# Altium project Nixie_Driver.PrjPcb
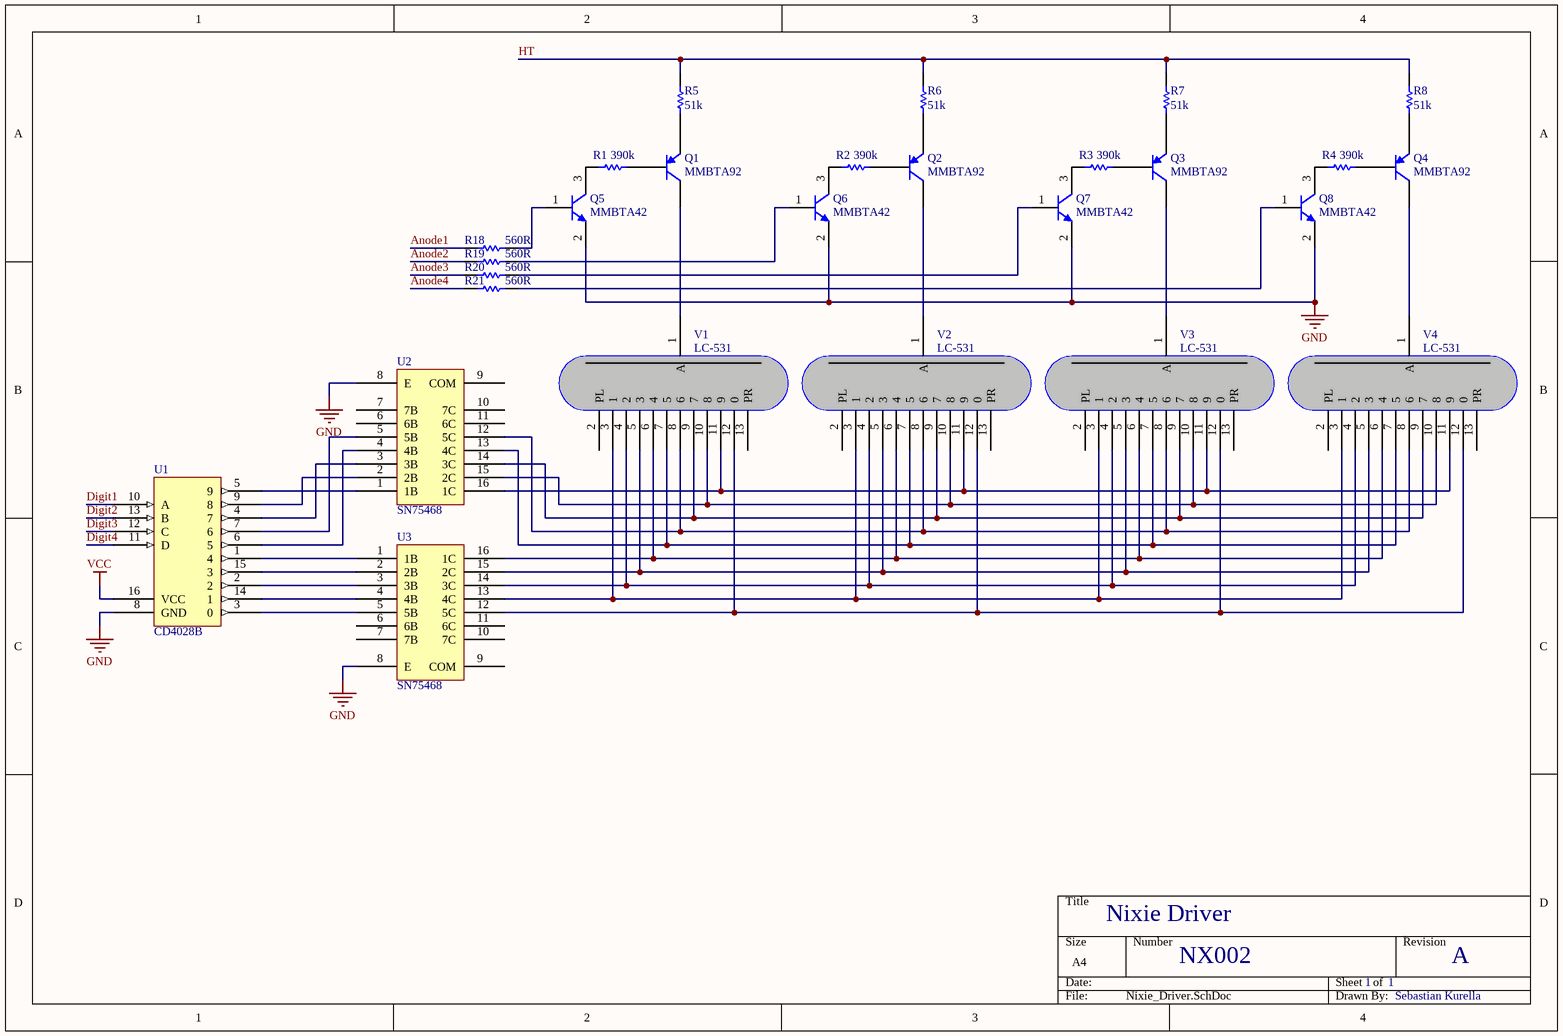
[diagram p0: Nixie_Driver.SchDoc]
3 sheets, 84 parts. Net scope: global (net labels, ports and power ports of the same name join across sheets).
Board file: Nixie_Driver.PcbDoc
Sheets:
  Nixie_Driver.SchDoc
  Nixie_Embedded_Controller.SchDoc
  Nixie_Embedded_Supply.SchDoc

## Sheet Nixie_Driver.SchDoc
size A4

### Parts
Q1  MMBTA92  [INF-SOT23_M]
Q2  MMBTA92  [INF-SOT23_M]
Q3  MMBTA92  [INF-SOT23_M]
Q4  MMBTA92  [INF-SOT23_M]
Q5  MMBTA42  [ONSC-SOT-23-3-318-08_V]
Q6  MMBTA42  [ONSC-SOT-23-3-318-08_V]
Q7  MMBTA42  [ONSC-SOT-23-3-318-08_V]
Q8  MMBTA42  [ONSC-SOT-23-3-318-08_V]
R1  value 390k  [RESC0805(2012)_M]  (hidden comment: 390K 5% 0805(2012))
R2  value 390k  [RESC0805(2012)_M]  (hidden comment: 390K 5% 0805(2012))
R3  value 390k  [RESC0805(2012)_M]  (hidden comment: 390K 5% 0805(2012))
R4  value 390k  [RESC0805(2012)_M]  (hidden comment: 390K 5% 0805(2012))
R5  value 51k  [RESC0805(2012)_M]  (hidden comment: 51K 5% 0805(2012))
R6  value 51k  [RESC0805(2012)_M]  (hidden comment: 51K 5% 0805(2012))
R7  value 51k  [RESC0805(2012)_M]  (hidden comment: 51K 5% 0805(2012))
R8  value 51k  [RESC0805(2012)_M]  (hidden comment: 51K 5% 0805(2012))
R18  560R  [RESC0805(2012)_M]
R19  560R  [RESC0805(2012)_M]
R20  560R  [RESC0805(2012)_M]
R21  560R  [RESC0805(2012)_M]
U1  CD4028B  [CD4028B]
U2  SN75468  [SN7546x]
U3  SN75468  [SN7546x]
V1  LC-531  [LC-531]
V2  LC-531  [LC-531]
V3  LC-531  [LC-531]
V4  LC-531  [LC-531]

### Nets
GND: Q5.2(E) Q6.2(E) Q7.2(E) Q8.2(E) U1.8(GND) U2.8(E) U3.8(E)
VCC: U1.16(VCC)
Anode1: R18.1
Anode2: R19.1
Anode3: R20.1
Anode4: R21.1
Digit1: U1.10(A)
Digit2: U1.13(B)
Digit3: U1.12(C)
Digit4: U1.11(D)
HT: R5.2 R6.2 R7.2 R8.2
NetQ1_1: Q1.1(B) R1.2
NetQ1_2: Q1.2(E) R5.1
NetQ1_3: Q1.3(C) V1.1(A)
NetQ2_1: Q2.1(B) R2.2
NetQ2_2: Q2.2(E) R6.1
NetQ2_3: Q2.3(C) V2.1(A)
NetQ3_1: Q3.1(B) R3.2
NetQ3_2: Q3.2(E) R7.1
NetQ3_3: Q3.3(C) V3.1(A)
NetQ4_1: Q4.1(B) R4.2
NetQ4_2: Q4.2(E) R8.1
NetQ4_3: Q4.3(C) V4.1(A)
NetQ5_1: Q5.1(B) R18.2
NetQ5_3: Q5.3(C) R1.1
NetQ6_1: Q6.1(B) R19.2
NetQ6_3: Q6.3(C) R2.1
NetQ7_1: Q7.1(B) R20.2
NetQ7_3: Q7.3(C) R3.1
NetQ8_1: Q8.1(B) R21.2
NetQ8_3: Q8.3(C) R4.1
NetU1_1: U1.1(4) U3.1(1B)
NetU1_2: U1.2 U3.3(3B)
NetU1_3: U1.3(0) U3.5(5B)
NetU1_4: U1.4(7) U2.3(3B)
NetU1_5: U1.5(9) U2.1(1B)
NetU1_6: U1.6(5) U2.4(4B)
NetU1_7: U1.7(6) U2.5(5B)
NetU1_9: U1.9(8) U2.2(2B)
NetU1_14: U1.14(1) U3.4(4B)
NetU1_15: U1.15(3) U3.2(2B)
NetU2_12: U2.12(5C) V1.8(6) V2.8(6) V3.8(6) V4.8(6)
NetU2_13: U2.13(4C) V1.7(5) V2.7(5) V3.7(5) V4.7(5)
NetU2_14: U2.14(3C) V1.9(7) V2.9(7) V3.9(7) V4.9(7)
NetU2_15: U2.15(2C) V1.10(8) V2.10(8) V3.10(8) V4.10(8)
NetU2_16: U2.16(1C) V1.11(9) V2.11(9) V3.11(9) V4.11(9)
NetU3_12: U3.12(5C) V1.12(0) V2.12(0) V3.12(0) V4.12(0)
NetU3_13: U3.13(4C) V1.3(1) V2.3(1) V3.3(1) V4.3(1)
NetU3_14: U3.14(3C) V1.4(2) V2.4(2) V3.4(2) V4.4(2)
NetU3_15: U3.15(2C) V1.5(3) V2.5(3) V3.5(3) V4.5(3)
NetU3_16: U3.16(1C) V1.6(4) V2.6(4) V3.6(4) V4.6(4)

Not connected (* = marked no-connect by the designer): U2 6(6B) 7(7B) 9(COM) 10(7C) 11(6C); U3 6(6B) 7(7B) 9(COM) 10(7C) 11(6C); V1 2(PL) 13(PR); V2 2(PL) 13(PR); V3 2(PL) 13(PR); V4 2(PL) 13(PR)

### Notes on the sheet
- Nixie Driver
- NX002
- 1
- A
- Sebastian Kurella

### Library data of the parts
Q1-Q4 = CMP-1197-00010-1: PNP Silicon High-Voltage Transistor, 300 V VCEO, 500 mA IC, SOT23, Reel, Green; Manufacturer: Infineon; hFE (min): 40; ICBO (max): 100 nA; Green: TRUE; VCE (max): 10 V; fT (typ): 50 MHz; IC (max): 500 mA; VEBO (max): 5 V; VCEO (max): 300 V; IC: 30 mA; ComponentLink3Description: Package Specification; ComponentLink2URL: http://www.infineon.com/dgdl/smbta92-mmbta92.pdf?folderId=db3a30431441fb5d011449af3ad90232&fileId=db3a30431441fb5d011449c5cd03023b; PartNumber: MMBTA92; ComponentLink1Description: Manufacturer URL; PackageReference: SOT23; Packing: Reel; ComponentLink3URL: http://www.infineon.com/dgdl/SOT23-Package_Overview.pdf?folderId=db3a30431936bc4b0119532290053c66&fileId=db3a30431936bc4b0119533468123c85; PackageVersion: Apr-08; PackageDescription: 3-Pin Small Outline Transistor Package, 1.3 x 2.9 mm Body, 0.95 mm Pitch; ComponentLink1URL: http://www.infineon.com/; Polarity: PNP; VCE: 10 V; Mounting Technology: Surface Mount; ComponentLink2Description: Datasheet; VCBO (max): 300 V
Q5-Q8 = CMP-1048-00662-1: High Voltage Transistor, NPN Silicon, 3-Pin SOT-23, Pb-Free, Tape and Reel; Manufacturer: On Semiconductor; fT Min (MHz): 50; IC Continuous (A): 0.5; ComponentLink1URL: http://www.onsemi.com/; ComponentLink3URL: http://www.onsemi.cn/pub_link/Collateral/318-08.PDF; RoHS: TRUE; ComponentLink2Description: Datasheet; PartNumber: MMBTA42; Polarity: NPN; DatasheetVersion: Rev. 12; PackageReference: SOT-23-3-318-08; PackageDescription: 3-Pin Small Outline Transistor, Body 2.92 x 1.3 mm, Pitch 0.95 mm; ComponentLink3Description: Package Specification; ComponentLink1Description: Manufacturer URL; Packing: Tape and Reel; PackageVersion: Rev. AP, 11/2009; Mounting Technology: Surface Mount; ComponentLink2URL: http://www.onsemi.cn/pub_link/Collateral/MMBTA42LT1-D.PDF
R1-R4 = CMP-1013-00136-1: 390K 0.125W 5% 0805 (2012 Metric)  SMD; Case-EIA: 0805; Case-Metric: 2012; Tolerance: 5 %; Power: 0.125 W; Technology: SMT
R5-R8 = CMP-1013-00115-1: 51K 0.125W 5% 0805 (2012 Metric)  SMD; Case-Metric: 2012; Case-EIA: 0805; Technology: SMT; Power: 0.125 W; Tolerance: 5 %
R18-R21 = CMP-1013-00068-1: 560R 0.125W 5% 0805 (2012 Metric)  SMD; Case-Metric: 2012; Value: 560.00 Ohm; Case-EIA: 0805; Power: 0.125 W; Technology: SMT; Tolerance: 5 %
U1 = CD4028B: BCD-to-decimal driver
U2 U3 = SN7546x: Darlington Transistor Array
V1-V4 = LC531: Nixie tube

## Sheet Nixie_Embedded_Controller.SchDoc
size A4
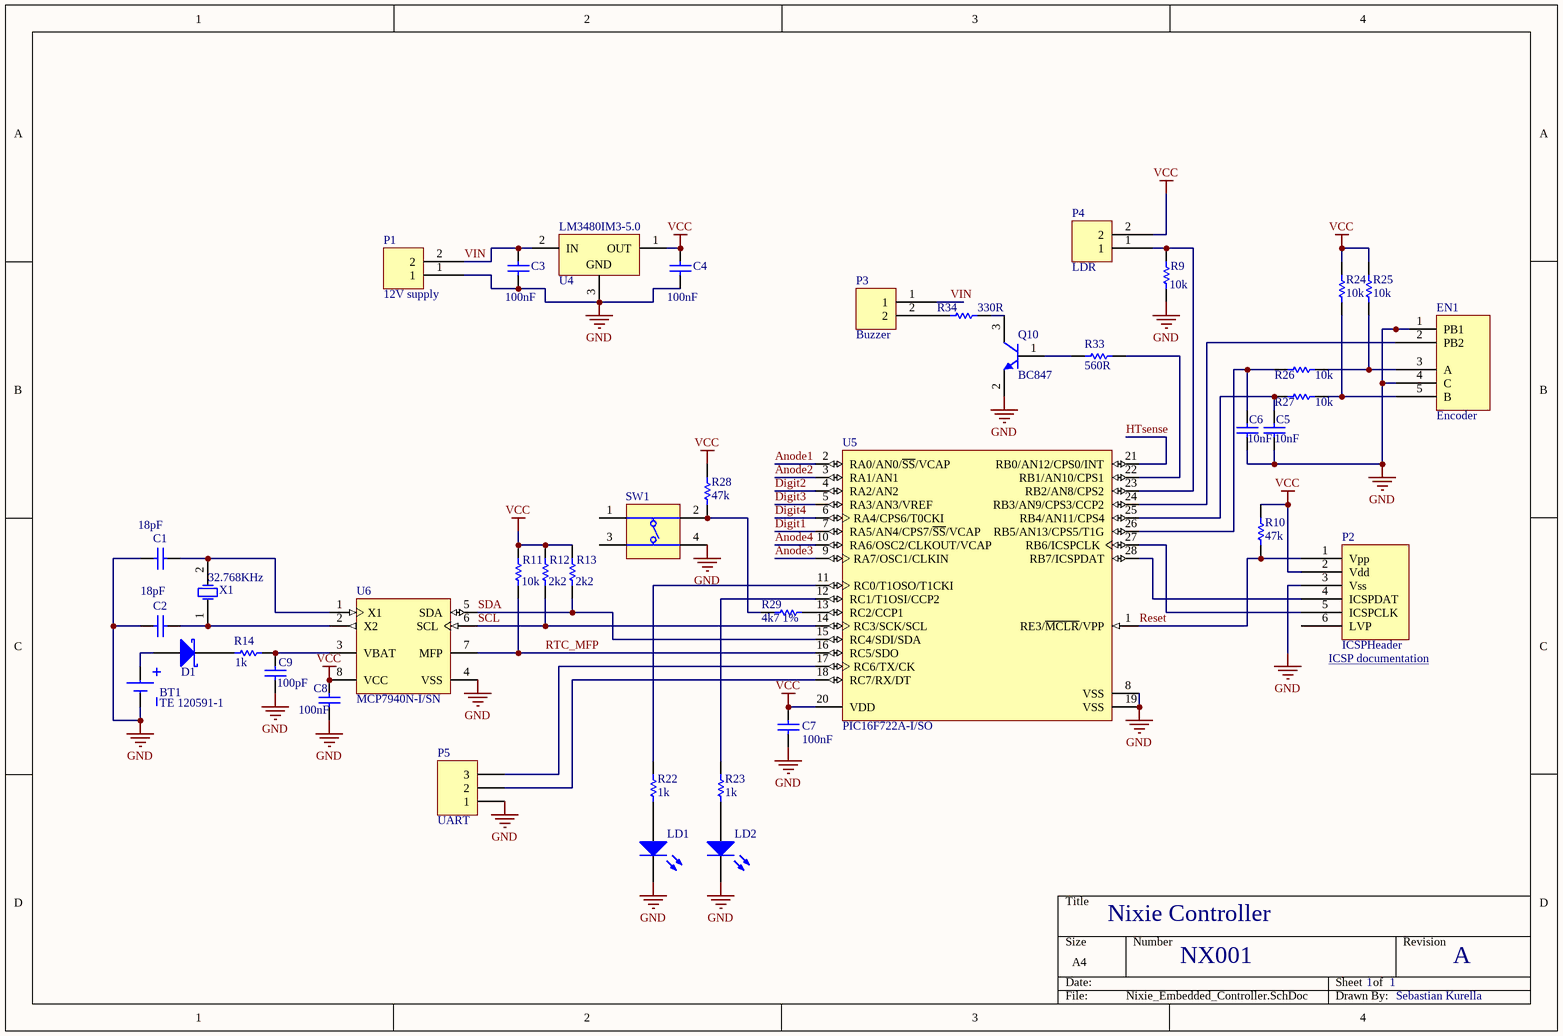
[diagram p1: Nixie_Embedded_Controller.SchDoc]

### Parts
BT1  TE 120591-1  [TE-120591-1]
C1  value 18pF  [CAPC0805(2012)100_M]  (hidden comment: CAP 18pF 16V 0805(2012))
C2  value 18pF  [CAPC0805(2012)100_M]  (hidden comment: CAP 18pF 16V 0805(2012))
C3  value 100nF  [CAPC0805(2012)100_M]  (hidden comment: CAP 100nF 16V 0805(2012))
C4  value 100nF  [CAPC0805(2012)100_M]  (hidden comment: CAP 100nF 16V 0805(2012))
C5  10nF  [CAPC0805(2012)100_M]
C6  10nF  [CAPC0805(2012)100_M]
C7  value 100nF  [CAPC0805(2012)100_M]  (hidden comment: CAP 100nF 10V 0805(2012))
C8  value 100nF  [CAPC0805(2012)100_M]  (hidden comment: CAP 100nF 10V 0805(2012))
C9  value 100pF  [CAPC0805(2012)100_M]  (hidden comment: CAP 100pF 10V 0805(2012))
D1  Schottky  [SOD-123]  (value not drawn)
EN1  Encoder  [BOURNS_PEC12R_ENCODER]
LD1  150080GS75000  [0805_A]  (value not drawn)
LD2  150080RS75000  [0805_A]  (value not drawn)
P1  12V supply  [2pos terminal block 3.5mm]
P2  ICSPHeader  [ICSPHDR]
P3  Buzzer  [2pos terminal block 3.5mm]
P4  LDR  [Header 1x2]
P5  UART  [HDR1X3]
Q10  BC847  [ONSC-SOT-23-3-318-08_V]
R9  value 10k  [RESC0805(2012)_M]  (hidden comment: 10K 5% 0805(2012))
R10  value 47k  [RESC0805(2012)_M]  (hidden comment: 47K 5% 0805(2012))
R11  value 10k  [RESC0805(2012)_M]  (hidden comment: 10K 5% 0805(2012))
R12  value 2k2  [RESC0805(2012)_M]  (hidden comment: 2K2 5% 0805(2012))
R13  value 2k2  [RESC0805(2012)_M]  (hidden comment: 2K2 5% 0805(2012))
R14  value 1k  [RESC0805(2012)_M]  (hidden comment: 1K 5% 0805(2012))
R22  1k  [RESC0805(2012)_M]
R23  1k  [RESC0805(2012)_M]
R24  10k  [RESC0805(2012)_M]
R25  10k  [RESC0805(2012)_M]
R26  10k  [RESC0805(2012)_M]
R27  10k  [RESC0805(2012)_M]
R28  47k  [RESC0805(2012)_L]
R29  4k7 1%  [RESC0805(2012)_M]
R33  560R  [RESC0805(2012)_M]
R34  330R  [RESC0805(2012)_M]
SW1  DTSM-61NT/R  [DIPT-DTSM-6_V]  (value not drawn)
U4  LM3480IM3-5.0  [MF03A_N]
U5  PIC16F722A-I/SO  [MCHP-SOIC-SO28_M]
U6  MCP7940N-I/SN  [SOIC-SN8_M]
X1  32.768KHz  [ABRA-ABS07-2_V]

### Nets
GND: BT1.2(-) C1.1 C2.1 C3.1 C4.1 C5.1 C6.1 C7.1 C8.1 C9.1 EN1.1(PB1) EN1.4(C) LD1.1(K) LD2.1(K) P1.1 P2.3(Vss) P5.1 Q10.2(E) R9.1 SW1.4(T3) U4.3(GND) U5.8(VSS) U5.19(VSS) U6.4(VSS)
VCC: C4.2 C7.2 C8.2 P2.2(Vdd) P4.2 R10.2 R11.2 R12.2 R13.2 R24.2 R25.2 R28.2 U4.1(OUT) U5.20(VDD) U6.8(VCC)
Anode1: U5.2(RA0/AN0/~{SS}/VCAP)
Anode2: U5.3(RA1/AN1)
Anode3: U5.9(RA7/OSC1/CLKIN)
Anode4: U5.10(RA6/OSC2/CLKOUT/VCAP)
Digit1: U5.7(RA5/AN4/CPS7/~{SS}/VCAP)
Digit2: U5.4(RA2/AN2)
Digit3: U5.5(RA3/AN3/VREF)
Digit4: U5.6(RA4/CPS6/T0CKI)
HTsense: U5.21(RB0/AN12/CPS0/INT)
Reset: P2.1(Vpp) R10.1 U5.1(RE3/~{MCLR}/VPP)
RTC_MFP: R11.1 U5.16(RC5/SDO) U6.7(MFP)
SCL: R12.1 U5.14(RC3/SCK/SCL) U6.6(SCL)
SDA: R13.1 U5.15(RC4/SDI/SDA) U6.5(SDA)
VIN: C3.2 P1.2 P3.1 U4.2(IN)
NetBT1_1: BT1.1(+) D1.1(A)
NetC1_2: C1.2 U6.1(X1) X1.2(X2)
NetC2_2: C2.2 U6.2(X2) X1.1(X1)
NetC5_2: C5.2 R27.2 U5.25(RB4/AN11/CPS4)
NetC6_2: C6.2 R26.2 U5.26(RB5/AN13/CPS5/T1G)
NetC9_2: C9.2 R14.2 U6.3(VBAT)
NetD1_2: D1.2(K) R14.1
NetEN1_2: EN1.2(PB2) U5.24(RB3/AN9/CPS3/CCP2)
NetEN1_3: EN1.3(A) R25.1 R26.1
NetEN1_5: EN1.5(B) R24.1 R27.1
NetLD1_2: LD1.2(A) R22.1
NetLD2_2: LD2.2(A) R23.1
NetP2_4: P2.4(ICSPDAT) U5.28(RB7/ICSPDAT)
NetP2_5: P2.5(ICSPCLK) U5.27(RB6/ICSPCLK)
NetP3_2: P3.2 R34.1
NetP4_1: P4.1 R9.2 U5.23(RB2/AN8/CPS2)
NetP5_2: P5.2 U5.18(RC7/RX/DT)
NetP5_3: P5.3 U5.17(RC6/TX/CK)
NetQ10_1: Q10.1(B) R33.1
NetQ10_3: Q10.3(C) R34.2
NetR22_2: R22.2 U5.11(RC0/T1OSO/T1CKI)
NetR23_2: R23.2 U5.12(RC1/T1OSI/CCP2)
NetR28_1: R28.1 R29.2 SW1.2(T2)
NetR29_1: R29.1 U5.13(RC2/CCP1)
NetR33_2: R33.2 U5.22(RB1/AN10/CPS1)

Not connected (* = marked no-connect by the designer): P2 6(LVP); SW1 1(T1) 3(T3)

### Notes on the sheet
- (near P2) ICSP documentation <http://ww1.microchip.com/downloads/en/DeviceDoc/PICkit_3_User_Guide_51795A.pdf#page=15>
- Nixie Controller
- NX001
- 1
- A
- Sebastian Kurella

### Library data of the parts
BT1 = TECO-120591-1-2: pin to pad: 2>3
C1 C2 = CMP-1036-01121-1: CAP 18pF 16V ±5% 0805 (2012 Metric) Thickness 1mm SMD; Case-Metric: 2012; Case-EIA: 0805; Tolerance: ±5%; Rated Voltage: 16 V; Max Thickness: 1 mm; Technology: SMT
C3 C4 = CMP-1036-04405-1: CAP 100nF 16V ±20% 0805 (2012 Metric) Thickness 1mm SMD; Case-EIA: 0805; Case-Metric: 2012; Tolerance: ±20%; Max Thickness: 1 mm; Rated Voltage: 16 V; Technology: SMT
C5 C6 = CMP-1036-03820-1: CAP 10nF 16V ±10% 0805 (2012 Metric) Thickness 1mm SMD; Case-Metric: 2012; Case-EIA: 0805; Rated Voltage: 16 V; Tolerance: ±10%; Value: 10nF; Technology: SMT; Max Thickness: 1 mm
C7 C8 = CMP-1036-04393-1: CAP 100nF 10V ±5% 0805 (2012 Metric) Thickness 1mm SMD; Case-EIA: 0805; Case-Metric: 2012; Rated Voltage: 10 V; Tolerance: ±5%; Technology: SMT; Max Thickness: 1 mm
C9 = CMP-1036-01930-1: CAP 100pF 10V ±2% 0805 (2012 Metric) Thickness 1mm SMD; Case-EIA: 0805; Case-Metric: 2012; Technology: SMT; Max Thickness: 1 mm; Rated Voltage: 10 V; Tolerance: ±2%
LD1 = CMP-1426-00007-1: SMD mono-color Chip LED, WL-SMCW, Green; Manufacturer: Wuerth Elektronik; PackageReference: 0805_A; Color: Green; PartNumber: 150080GS75000; ComponentLink2URL: http://katalog.we-online.com/led/datasheet/150080GS75000.pdf; ComponentLink1URL: http://www.we-online.com; ComponentLink1Description: Manufacturer URL; ComponentLink2Description: Datasheet
LD2 = CMP-1426-00011-1: SMD mono-color Chip LED, WL-SMCW, Red; Manufacturer: Wuerth Elektronik; Color: Red; PartNumber: 150080RS75000; PackageReference: 0805_A; ComponentLink2Description: Datasheet; ComponentLink1URL: http://www.we-online.com; ComponentLink1Description: Manufacturer URL; ComponentLink2URL: http://katalog.we-online.com/led/datasheet/150080RS75000.pdf
P1 P3 = 2pos terminal block 3.5mm: TE 1776275-2
P4 = Header 1x2: TE 640456-2
P5 = Header 3: Header, 3-Pin; LatestRevisionDate: 17-Jul-2002; LatestRevisionNote: Re-released for DXP Platform.; Publisher: Altium Limited
Q10 = CMP-1048-00018-1: General Purpose Transistor, NPN Silicon, 3-Pin SOT-23, Tape and Reel; Manufacturer: On Semiconductor; PartNumber: BC847ALT1; fT Min (MHz): 100; IC Continuous (A): 0.1; ComponentLink3URL: http://www.onsemi.cn/pub_link/Collateral/318-08.PDF; PackageVersion: Rev. AP, 11/2009; DatasheetVersion: Rev. 11; ComponentLink1Description: Manufacturer URL; ComponentLink1URL: http://www.onsemi.com/; ComponentLink2Description: Datasheet; RoHS: FALSE; PackageDescription: 3-Pin Small Outline Transistor, Body 2.92 x 1.3 mm, Pitch 0.95 mm; Packing: Tape and Reel; ComponentLink3Description: Package Specification; Polarity: NPN; ComponentLink2URL: http://www.onsemi.cn/pub_link/Collateral/BC846ALT1-D.PDF; PackageReference: SOT-23-3-318-08; Mounting Technology: Surface Mount
R9 R11 = CMP-1013-00098-1: 10K 0.125W 5% 0805 (2012 Metric)  SMD; Case-EIA: 0805; Case-Metric: 2012; Power: 0.125 W; Technology: SMT; Tolerance: 5 %
R10 = CMP-1013-00114-1: 47K 0.125W 5% 0805 (2012 Metric)  SMD; Case-Metric: 2012; Case-EIA: 0805; Tolerance: 5 %; Power: 0.125 W; Technology: SMT
R12 R13 = CMP-1013-00082-1: 2K2 0.125W 5% 0805 (2012 Metric)  SMD; Case-EIA: 0805; Case-Metric: 2012; Power: 0.125 W; Tolerance: 5 %; Technology: SMT
R14 = CMP-1013-00074-1: 1K 0.125W 5% 0805 (2012 Metric)  SMD; Case-EIA: 0805; Case-Metric: 2012; Technology: SMT; Power: 0.125 W; Tolerance: 5 %
R22 R23 = CMP-1013-00074-1: 1K 0.125W 5% 0805 (2012 Metric)  SMD; Case-EIA: 0805; Case-Metric: 2012; Value: 1000.00 Ohm; Technology: SMT; Power: 0.125 W; Tolerance: 5 %
R24-R27 = CMP-1013-00098-1: 10K 0.125W 5% 0805 (2012 Metric)  SMD; Case-EIA: 0805; Case-Metric: 2012; Value: 10000.00 Ohm; Power: 0.125 W; Technology: SMT; Tolerance: 5 %
R28 = CMP-1013-00114-1: 47K 0.125W 5% 0805 (2012 Metric)  SMD; Case-Metric: 2012; Case-EIA: 0805; Value: 47000.00 Ohm; Tolerance: 5 %; Power: 0.125 W; Technology: SMT
R29 = CMP-1013-00586-1: 4K7 0.125W 1% 0805 (2012 Metric)  SMD; Case-Metric: 2012; Case-EIA: 0805; Value: 4700.00 Ohm; Technology: SMT; Power: 0.125 W; Tolerance: 1 %
R33 = CMP-1013-00068-1: as R18 on sheet Nixie_Driver; Power: 0.125 W; Technology: SMT; Tolerance: 5 %
R34 = CMP-1013-00062-1: 330R 0.125W 5% 0805 (2012 Metric)  SMD; Value: 330.00 Ohm; Case-EIA: 0805; Case-Metric: 2012; Tolerance: 5 %; Power: 0.125 W; Technology: SMT
SW1 = CMP-0306-00001-1: Switch, SPNO Push Button SMD; Manufacturer: Diptronics; Packing Type: Tape&Reel; Mechanical Life: 200,000 cycles; ComponentLink2URL: http://www.dip.com.tw/Products_tact.htm; ComponentLink1URL: http://www.dip.com.tw/; ComponentLink3URL: http://www.dip.com.tw/PDF/pro_tact/DTSM_G_-6_2_-V.pdf; PackageDescription: Switch, Through-Hole, 4 Leads, Body 8.5x8.5mm, Row Spacing 9.0mm, Pitch 4.5mm; ComponentLink2Description: Datasheet; ComponentLink3Description: Package Specification; ComponentLink1Description: Manufacturer URL; PackageReference: DTSM-6; PartNumber: DTSM-61NT/R; Mounting Technology: Through Hole
U4 = CMP-0062-02200-1: 100 mA, Quasi Low-Dropout Linear Voltage Regulator, 3-pin SOT-23, Pb-Free; Manufacturer: National Semiconductor; PackageTopMarking: L0B*XTT; PowerWise: N; CompType: LDO IC; PackageDescription: Molded SOT-23, .115 x .051 x .037in Body, 3 Lead, .075 in Pitch; PackageReference: MF03A; PinCount: 3; PackageVersion: revB, Mar-2003; RoHS: Y; DatasheetVersion: Mar-2005
U5 = CMP-0115-02602-1: Flash Microcontroller with nanoWatt XLP Technology, 20 MHz, 24 I/O, -40 to 85 degC, 28-pin SOIC (SO28), Tube; Manufacturer: Microchip; I/O Pins: 24; # of A/D Channels: 11; Digital Communication: 1 -A/E/USART, 1 -SSP(SPI/I2C); RAM: 128; Max. CPU Speed MHz: 20; Program Memory KWords: 2; Program Memory KBytes: 3.5; Internal Oscillator: 16 MHz, 500 kHz; Operation Voltage Range: 1.8V - 5.5V; Timers: 2 - 8-bit, 1 - 16-bit, 0 - 32-bit; ComponentLink2Description: Package Specification; ComponentLink2URL: http://www.microchip.com/stellent/groups/techpub_sg/documents/packagingspec/en012702.pdf; PartNumber: PIC16F722A-I/SO; ComponentLink3Description: URL Link1; Memory Type: Flash; PackageReference: SOIC-SO28; PackageVersion: C04-052C, 12/2012; ComponentLink3URL: Product URL:http://www.microchip.com/datasheet/PIC16F722A; ComponentLink1Description: Datasheet; ComponentLink1URL: http://ww1.microchip.com/downloads/en/DeviceDoc/41417B.pdf; Packing: TUBE; Mounting Technology: Surface Mount; RoHS: TRUE; DatasheetVersion: Rev. B; PackageDescription: 28-Lead Plastic Small Outline, 17.9 x 7.5 mm Body, 1.27 mm Pitch
U6 = CMP-0186-00196-1: Low-Cost I2C Real-Time Clock/Calendar with SRAM and Battery Switchover, 8-Pin SOIC, Industrial Temperature; PackageDescription: 8-Lead Plastic Small Outline (SN) - Narrow, 3.90mm Body [SOIC]; Code_JEDEC: MS-012; ComponentLink2Description: Datasheet; DatasheetVersion: revC, Dec-2011; ComponentLink3Description: Package Specification; ComponentLink2URL: http://ww1.microchip.com/downloads/en/DeviceDoc/25010C.pdf; PackageVersion: revBB, Aug-2009; ComponentLink3URL: http://www.microchip.com/stellent/groups/techpub_sg/documents/packagingspec/en012702.pdf; ComponentLink1URL: http://www.microchip.com/; ComponentLink1Description: Manufacturer URL; Code_IPC: SOIC127P600-8; PackageReference: SOIC-SN8; Supplier 1: Farnell; Supplier Part Number 1: 2361122
X1 = CMP-0447-00001-1: Crystal, 32.768 kHz, 12.5 pF, -40 to 85 degC, SMD Low Profile 3.2 x 1.5 x 0.9 mm, Tape and Reel; PartNumber: ABS07-32.768KHz-T; Manufacturer: Abracon; Drive Level (Type): 0.1 uW; Operation Mode: Flexural Mode (Tuning Fork); Shunt Capacitance (C0): 0.9 to 1.2 pF; Equivalent Series Resistance (R1): 70 Kohm; Insulation Resistance (Min): 500 Mohm; Q Value (Type): 30000; Frequency Tolerance @+25degC: +/- 20 ppm; Load Capacitance (CL): 12.5 pF; Operating Temperature: -40 to 85 degC; ComponentLink3Description: Package Specification; DatasheetVersion: 04.03.13; Mounting Technology: Surface Mount; Frequency: 32.768 kHz; ComponentLink1URL: http://www.abracon.com/; Packing: Tape and Reel; ComponentLink3URL: http://www.abracon.com/Resonators/ABS07.pdf; ComponentLink2Description: Datasheet; PackageDescription: 2-Pin Hand Drawn, Body 3.2x1.5mm, Pitch 2.5mm; ComponentLink1Description: Manufacturer URL; PackageReference: ABS07-2; ComponentLink2URL: http://www.abracon.com/Resonators/ABS07.pdf
P2 = ICSPHeader: ComponentLink1Description: Documentation; ComponentLink1URL: http://ww1.microchip.com/downloads/en/DeviceDoc/PICkit_3_User_Guide_51795A.pdf#page=15

## Sheet Nixie_Embedded_Supply.SchDoc
size A4
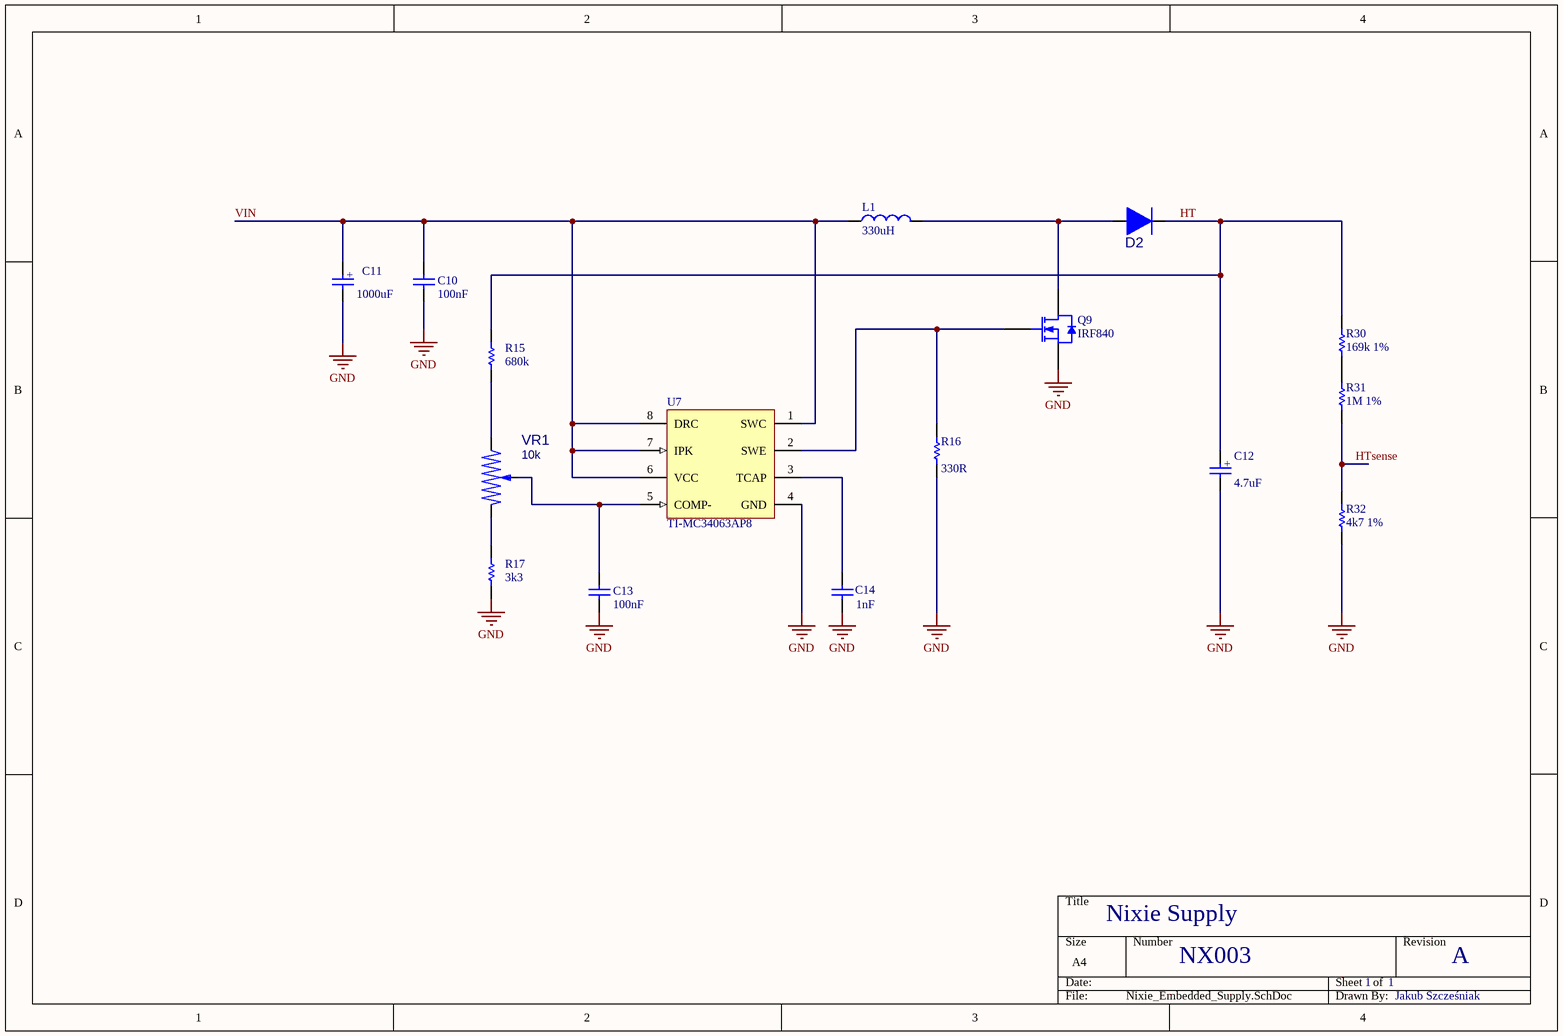
[diagram p2: Nixie_Embedded_Supply.SchDoc]

### Parts
C10  value 100nF  [CAPC0805(2012)100_M]  (hidden comment: CAP 100nF 16V 0805(2012))
C11  value 1000uF  [CAPsmd_rad10]  (hidden comment: CAP_rad16x10)
C12  value 4.7uF  [CAP_HV]  (hidden comment: CAP_HV)
C13  value 100nF  [CAPC0805(2012)100_M]  (hidden comment: CAP 100nF 16V 0805(2012))
C14  value 1nF  [CAPC0805(2012)100_M]  (hidden comment: CAP 1nF 25V 0805(2012))
D2  BYV29-400  [D2PAK]  (value not drawn)
L1  330uH  [Coil]
Q9  IRF840  [D2PAK]
R15  value 680k  [RESC0805(2012)_M]  (hidden comment: 680K 5% 0805(2012))
R16  value 330R  [RESC0805(2012)_M]  (hidden comment: 330R 5% 0805(2012))
R17  value 3k3  [RESC0805(2012)_M]  (hidden comment: 3K3 1% 0805(2012))
R30  169k 1%  [RESC0805(2012)_M]
R31  1M 1%  [RESC0805(2012)_M]
R32  4k7 1%  [RESC0805(2012)_M]
U7  TI-MC34063AP8  [SOIC8]
VR1  10k  [POT7x5]

### Nets
GND: C10.1 C11.2 C12.2 C13.1 C14.1 Q9.3(S) R16.1 R17.1 R32.1 U7.4(GND)
HT: C12.1 D2.2(K) R15.2 R30.2
HTsense: R31.1 R32.2
VIN: C10.2 C11.1 L1.1 U7.1(SWC) U7.6(VCC) U7.7(IPK) U7.8(DRC)
NetC13_2: C13.2 U7.5(COMP-) VR1.2
NetC14_2: C14.2 U7.3(TCAP)
NetD2_1: D2.1(A) L1.2 Q9.2(D)
NetQ9_1: Q9.1(G) R16.2 U7.2(SWE)
NetR15_1: R15.1 VR1.3
NetR17_2: R17.2 VR1.1
NetR30_1: R30.1 R31.2

### Notes on the sheet
- Nixie Supply
- NX003
- 1
- A
- Jakub Szcześniak
- (in symbol CAP_HV) +
- (in symbol CAP_rad16x10) +

### Library data of the parts
C10 C13 = CMP-1036-04400-1: CAP 100nF 16V ±5% 0805 (2012 Metric) Thickness 1mm SMD; Case-EIA: 0805; Case-Metric: 2012; Max Thickness: 1 mm; Tolerance: ±5%; Technology: SMT; Rated Voltage: 16 V
C14 = CMP-1036-02963-1: CAP 1nF 25V ±1% 0805 (2012 Metric) Thickness 1mm SMD; Case-EIA: 0805; Case-Metric: 2012; Rated Voltage: 25 V; Max Thickness: 1 mm; Technology: SMT; Tolerance: ±1%
D2 = BYV29-400: pin to pad: 1>3; Part Number: 104-5508; Supplier: Farnell
L1 = L
R15 = CMP-1013-00142-1: 680K 0.125W 5% 0805 (2012 Metric)  SMD; Case-EIA: 0805; Case-Metric: 2012; Power: 0.125 W; Technology: SMT; Tolerance: 5 %
R16 = CMP-1013-00062-1: 330R 0.125W 5% 0805 (2012 Metric)  SMD; Case-EIA: 0805; Case-Metric: 2012; Tolerance: 5 %; Power: 0.125 W; Technology: SMT
R17 = CMP-1013-00567-1: 3K3 0.125W 1% 0805 (2012 Metric)  SMD; Case-Metric: 2012; Case-EIA: 0805; Technology: SMT; Tolerance: 1 %; Power: 0.125 W
R30 = CMP-1013-00760-1: 169K 0.125W 1% 0805 (2012 Metric)  SMD; Case-Metric: 2012; Value: 169000.00 Ohm; Case-EIA: 0805; Power: 0.125 W; Technology: SMT; Tolerance: 1 %
R31 = CMP-1013-00849-1: 1M 0.125W 1% 0805 (2012 Metric)  SMD; Value: 1000000.00 Ohm; Case-Metric: 2012; Case-EIA: 0805; Technology: SMT; Power: 0.125 W; Tolerance: 1 %
R32 = CMP-1013-00586-1: as R29 on sheet Nixie_Embedded_Controller; Technology: SMT; Power: 0.125 W; Tolerance: 1 %
VR1 = RESPOT_ST-V01: Potentiometer; Part Number: 119-1725; Supplier: Farnell

## Nets that join several sheets
GND: Nixie_Driver (7 pins), Nixie_Embedded_Controller (24 pins), Nixie_Embedded_Supply (10 pins)
VCC: Nixie_Driver (U1.16), Nixie_Embedded_Controller (15 pins)
Anode1: Nixie_Driver (R18.1), Nixie_Embedded_Controller (U5.2)
Anode2: Nixie_Driver (R19.1), Nixie_Embedded_Controller (U5.3)
Anode3: Nixie_Driver (R20.1), Nixie_Embedded_Controller (U5.9)
Anode4: Nixie_Driver (R21.1), Nixie_Embedded_Controller (U5.10)
Digit1: Nixie_Driver (U1.10), Nixie_Embedded_Controller (U5.7)
Digit2: Nixie_Driver (U1.13), Nixie_Embedded_Controller (U5.4)
Digit3: Nixie_Driver (U1.12), Nixie_Embedded_Controller (U5.5)
Digit4: Nixie_Driver (U1.11), Nixie_Embedded_Controller (U5.6)
HT: Nixie_Driver (R5.2 R6.2 R7.2 R8.2), Nixie_Embedded_Supply (C12.1 D2.2 R15.2 R30.2)
HTsense: Nixie_Embedded_Controller (U5.21), Nixie_Embedded_Supply (R31.1 R32.2)
VIN: Nixie_Embedded_Controller (C3.2 P1.2 P3.1 U4.2), Nixie_Embedded_Supply (7 pins)